# Altium schematic sheet Sheet2.SchDoc
size A4
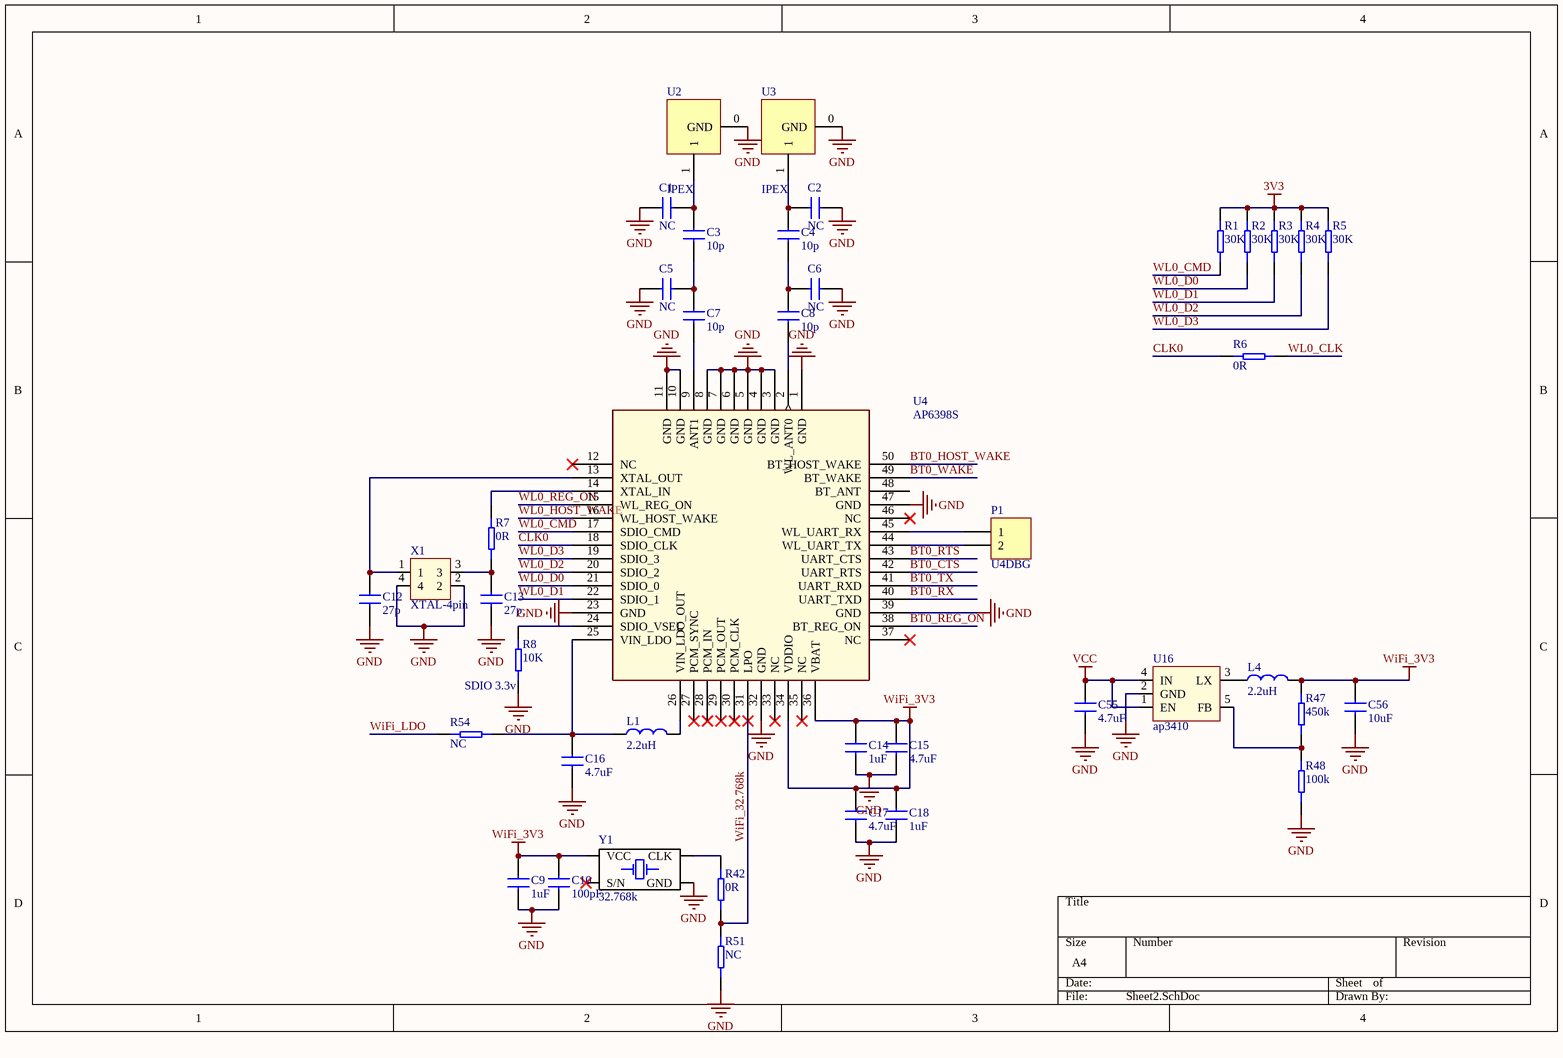
[diagram p0: Sheet2.SchDoc]

## Parts
C1  NC  [0402C]
C2  NC  [0402C]
C3  10p  [0402C]
C4  10p  [0402C]
C5  NC  [0402C]
C6  NC  [0402C]
C7  10p  [0402C]
C8  10p  [0402C]
C9  1uF  [0402C]
C10  100pF  [0402C]
C12  27p  [0402C]
C13  27p  [0402C]
C14  1uF  [0402C]
C15  4.7uF  [0402C]
C16  4.7uF  [0603C]
C17  4.7uF  [0402C]
C18  1uF  [0402C]
C55  4.7uF  [0603C]
C56  10uF  [0603C]
L1  2.2uH  [0805R]
L4  2.2uH  [0805R]
P1  U4DBG  [MHDR1X2]
R1  30K  [0402R]
R2  30K  [0402R]
R3  30K  [0402R]
R4  30K  [0402R]
R5  30K  [0402R]
R6  0R  [0402R]
R7  0R  [0402R]
R8  10K  [0402R]
R42  0R  [0402R]
R47  450k  [0402R]
R48  100k  [0402R]
R51  NC  [0402R]
R54  NC  [0805R]
U2  IPEX  [IPEX]
U3  IPEX  [IPEX]
U4  AP6398S  [ap6398sr3]
U16  ap3410  [LC-SOT-23-5]
X1  XTAL-4pin  [LC-SMD-3225_4P]
Y1  32.768k  [3225]

## Nets
3V3: R1.2 R2.2 R3.2 R4.2 R5.2
GND: C1.1 C2.2 C5.1 C6.2 C9.2 C10.2 C12.2 C13.2 C14.2 C15.2 C16.1 C17.2 C18.2 C55.2 C56.2 R8.1 R48.1 R51.1 U2.0(GND) U3.0(GND) U4.1(GND) U4.3(GND) U4.4(GND) U4.5(GND) U4.6(GND) U4.7(GND) U4.8(GND) U4.10(GND) U4.11(GND) U4.23(GND) U4.32(GND) U4.39(GND) U4.47(GND) U16.2(GND) X1.2 X1.4 Y1.2(GND)
VCC: C55.1 U16.1(EN) U16.4(IN)
WiFi_3V3: C9.1 C10.1 C14.1 C15.1 C17.1 C18.1 C56.1 L4.1 R47.2 U4.34(VDDIO) U4.36(VBAT) Y1.4(VCC)
BT0_CTS: U4.42(UART_RTS)
BT0_HOST_WAKE: U4.50(BT_HOST_WAKE)
BT0_REG_ON: U4.38(BT_REG_ON)
BT0_RTS: U4.43(UART_CTS)
BT0_RX: U4.40(UART_TXD)
BT0_TX: U4.41(UART_RXD)
BT0_WAKE: U4.49(BT_WAKE)
CLK0: R6.2 U4.18(SDIO_CLK)
WiFi_32.768k: R42.1 R51.2 U4.31(LPO)
WiFi_LDO: R54.2
WL0_CLK: R6.1
WL0_CMD: R1.1 U4.17(SDIO_CMD)
WL0_D0: R2.1 U4.21(SDIO_0)
WL0_D1: R3.1 U4.22(SDIO_1)
WL0_D2: R4.1 U4.20(SDIO_2)
WL0_D3: R5.1 U4.19(SDIO_3)
WL0_HOST_WAKE: U4.16(WL_HOST_WAKE)
WL0_REG_ON: U4.15(WL_REG_ON)
NetC1_2: C1.2 C3.2 U2.1
NetC2_1: C2.1 C4.1 U3.1
NetC3_1: C3.1 C5.2 C7.1
NetC4_2: C4.2 C6.1 C8.1
NetC7_2: C7.2 U4.9(ANT1)
NetC8_2: C8.2 U4.2(WL_ANT0)
NetC12_1: C12.1 U4.13(XTAL_OUT) X1.1
NetC13_1: C13.1 R7.1 X1.3
NetC16_2: C16.2 L1.2 R54.1 U4.25(VIN_LDO)
NetL1_1: L1.1 U4.26(VIN_LDO_OUT)
NetL4_2: L4.2 U16.3(LX)
NetP1_1: P1.1 U4.45(WL_UART_RX)
NetP1_2: P1.2 U4.44(WL_UART_TX)
NetR7_2: R7.2 U4.14(XTAL_IN)
NetR8_2: R8.2 U4.24(SDIO_VSEL)
NetR42_2: R42.2 Y1.3(CLK)
NetR47_1: R47.1 R48.2 U16.5(FB)

Not connected (* = marked no-connect by the designer): U4 12(NC)* 27(PCM_SYNC)* 28(PCM_IN)* 29(PCM_OUT)* 30(PCM_CLK)* 33(NC)* 35(NC)* 37(NC)* 46(NC)* 48(BT_ANT); Y1 1(S/N)*

## Notes on the sheet
- (near R8) SDIO 3.3v

## Library data of the parts
C1-C10 C12-C18 C55 C56 = CAP: SMD-CAP
L1 = L1: LQM2MPN2R2NG0L
L4 = L1: LQM2MPN3R3NG0L
P1 = MHDR1X2: Header, 2-Pin; LatestRevisionDate: 17-Jul-2002; LatestRevisionNote: Re-released for DXP Platform.; Publisher: Altium Limited
R1-R8 R42 R47 R48 R51 R54 = R
X1 = XTAL-4pin: 37.4MHz
Y1 = XATL1: 3225 有源